# Altium schematic sheet LIDO-HW.100.Connectors_1.SchDoc
size A3; SheetNumber: 5; SheetTotal: 5
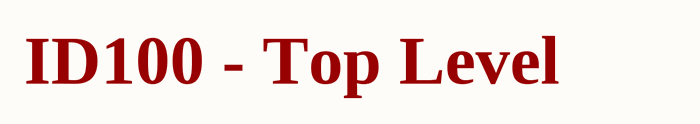
[diagram p0: LIDO-HW.100.Connectors_1.SchDoc]

## Notes on the sheet
- ID100 - Top Level
- Title:
- Size:
- Date:
- A3
- Sheet       of
- Engineer:
- Version:
- Part Number:
- Revision:
- Rev. date:
- Project:
- File: